# EAGLE design POE (EAGLE 6.2)
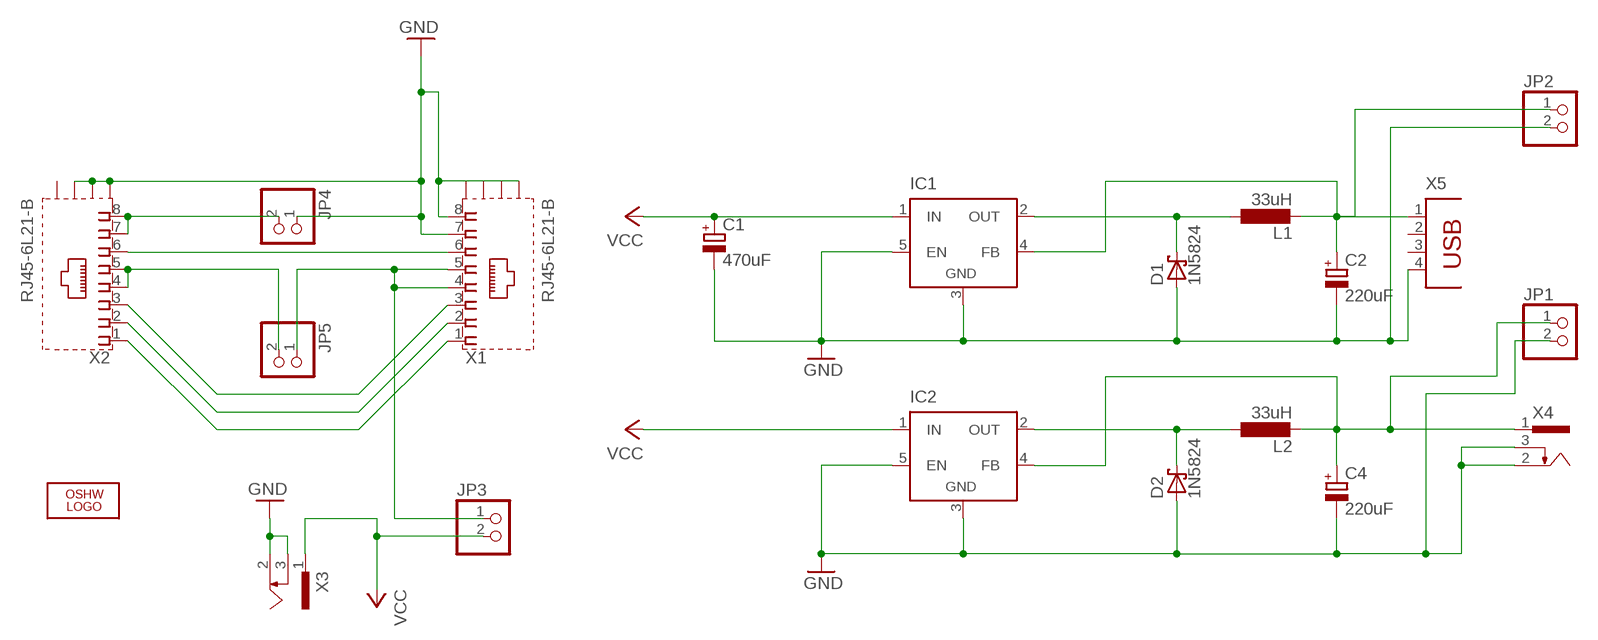
[diagram p0: schematic, sheet 1]

## Parts
C1  470uF  CPOL-EUE3.5-8  [E3,5-8]
C2  220uF  CPOL-EUE2.5-7  [E2,5-7]
C4  220uF  CPOL-EUE2.5-7  [E2,5-7]
D1  1N5824  BAT19  [DO35-10]
D2  1N5824  BAT19  [DO35-10]
IC1  LM2596TV  [TO220-51]
IC2  LM2596TV  [TO220-51]
JP1  PINHD-1X2  [1X02]
JP2  PINHD-1X2  [1X02]
JP3  PINHD-1X2  [1X02]
JP4  PINHD-1X2  [1X02]
JP5  PINHD-1X2  [1X02]
L1  33uH  L-EU6000-XXX-RC  [6000-XXXX-RC]
L2  33uH  L-EU6000-XXX-RC  [6000-XXXX-RC]
LOGO1  OSHW_LOGO_6MILX0200-NT  [OSHW_6X200_NOTEXT]
X1  RJ45-6L21-B  [RJ45-SHIELD1]
X2  RJ45-6L21-B  [RJ45-SHIELD1]
X3  733980-62  [733980-62]
X4  733980-62  [733980-62]
X5  PN87520  [PN87520]

## Nets
GND: C1.- C2.- C4.- D1.A D2.A IC1.3(GND) IC1.5(EN) IC2.3(GND) IC2.5(EN) JP1.2 JP2.2 JP4.1 X1.7 X1.8 X1.S1(S) X1.S2(S) X1.S4(S) X2.S1(S) X2.S2(S) X2.S3(S) X3.2 X3.3 X4.2 X4.3 X5.4
N$1: D1.C IC1.2(OUT) L1.1
N$2: C2.+ IC1.4(FB) JP2.1 L1.2 X5.1
N$3: X1.6 X2.6
N$4: D2.C IC2.2(OUT) L2.1
N$5: C4.+ IC2.4(FB) JP1.1 L2.2 X4.1
N$6: X1.3 X2.3
N$7: X1.2 X2.2
N$8: X1.1 X2.1
N$9: JP3.1 JP5.1 X1.4 X1.5
N$10: JP4.2 X2.7 X2.8
N$11: JP5.2 X2.4 X2.5
VCC: C1.+ IC1.1(IN) IC2.1(IN) JP3.2 X3.1
Unconnected: X1.S3(S) X2.S4(S) X5.2 X5.3

## Library data of the parts
C1 C2 C4 = rcl:CPOL-EU: POLARIZED CAPACITOR, European symbol
D1 D2 = diode:BAT19: DIODE barrier diode
IC1 IC2 = linear:LM2596T: STEP-DOWN VOLTAGE REGULATOR
JP1-JP5 = pinhead:PINHD-1X2: PIN HEADER
L1 L2 = rcl:L-EU: INDUCTOR, European symbol
LOGO1 = ohw-logo:OSHW_LOGO_6MIL
X1 X2 = con-tycoelectronics:RJ45*2: RJ45 Low Profile Shield Type 2 For all RJ45 L, LC, LCT and X Series Models Source: www.tycoelectronics.com .. ENG_DS_1654001_1099_RJ_L_0507.pdf; OC_FARNELL: unknown; OC_NEWARK: unknown
X3 X4 = con-conrad:73398?: FEMALE PRINT CONNECTOR Niedervolt-Steckverbinder Distributor Conrad
X5 = con-berg:PN87520: BERG USB connector; OC_FARNELL: unknown; OC_NEWARK: unknown

## Board
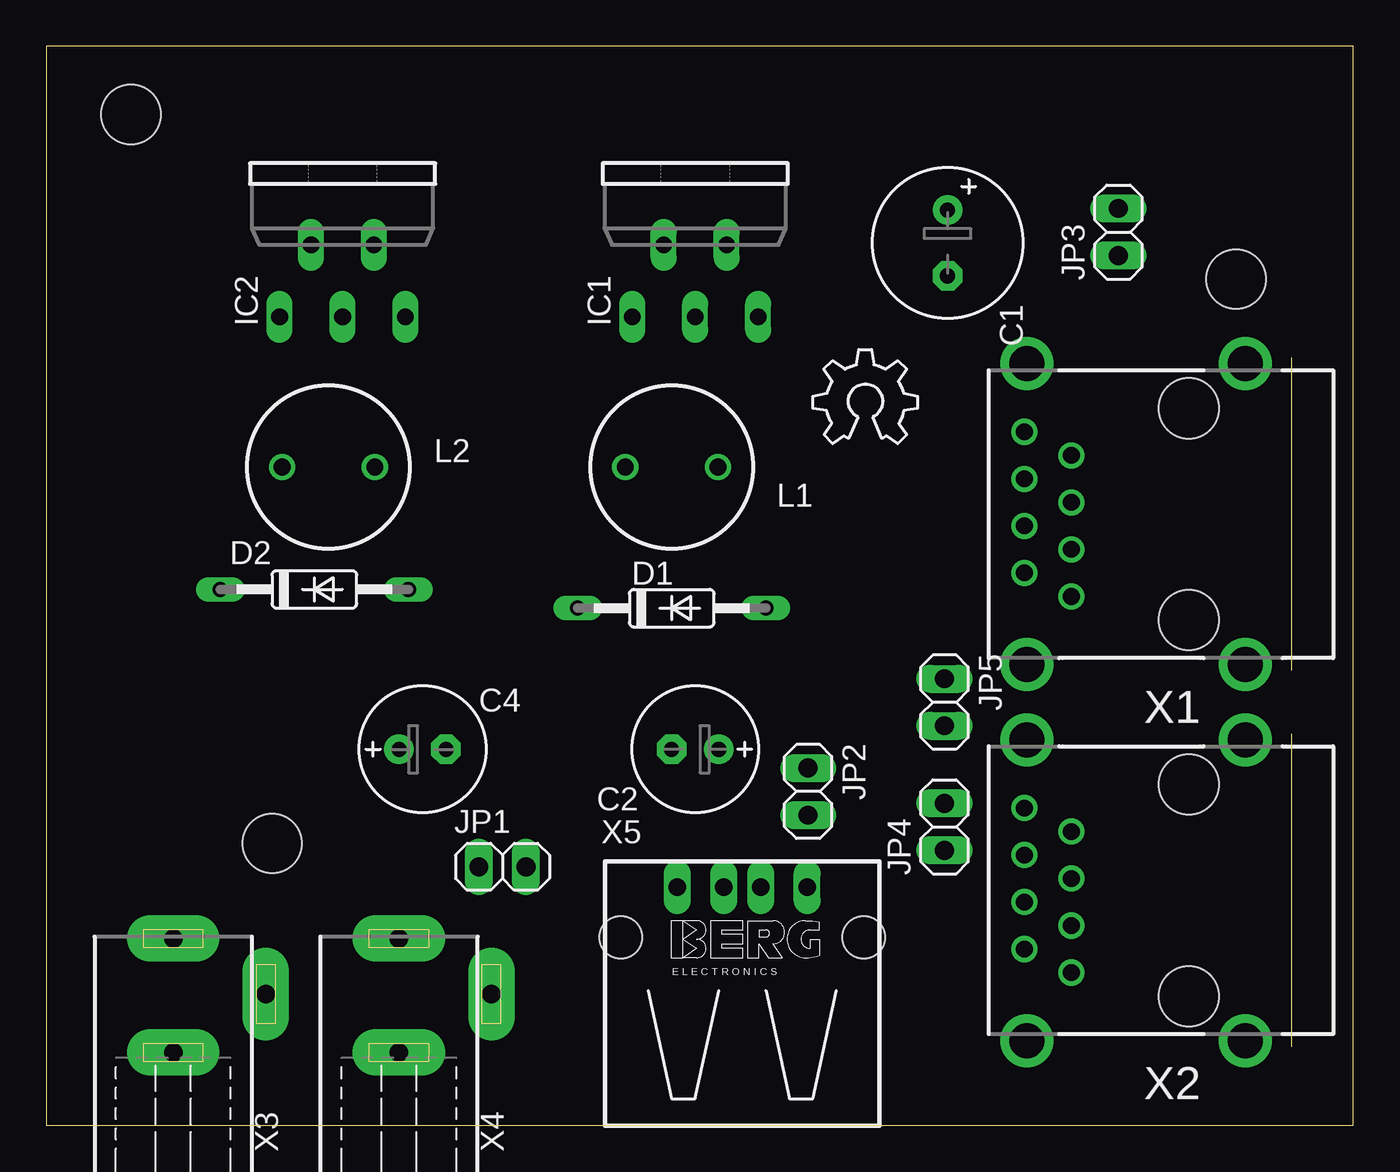
[diagram p1: board, top side]
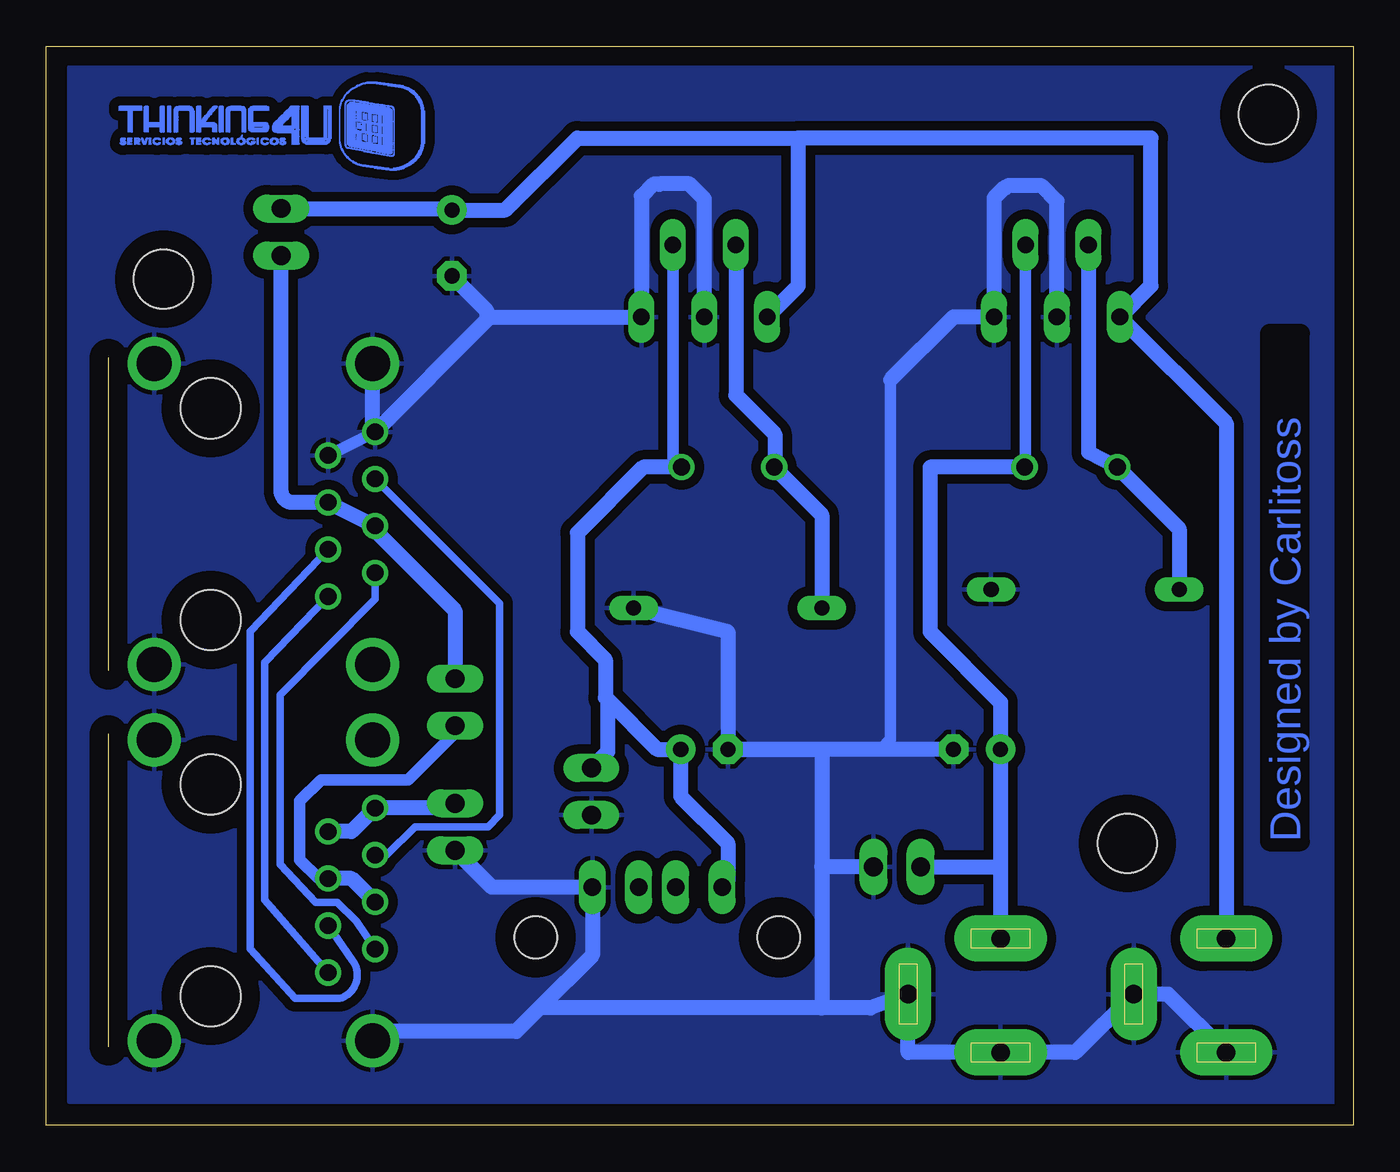
[diagram p2: board, bottom side, seen from below]

Size 70.59 x 58.29 mm. Coordinates in mm from the lower left corner, seen from the top.
Outline: 0,0 70.59,0 70.59,58.29 0,58.29 0,0
Copper layers (1*16): Top 0.035mm / dielectric 1.5mm / Bottom 0.035mm
Design rules: minimum track width 10mil, minimum drill 24mil, track to track 20mil, track to pad 20mil, pad to pad 15mil, via to via 8mil, smd to smd 8mil, copper to edge 40mil, drill to drill 8mil, minimum pad ring 10mil, minimum via ring 8mil, stop-mask expansion 4mil, vias tented up to drill 0mil, thermal gap 10mil
Holes 3.2 mm at 64.26,45.72 12.19,15.24 4.57,54.61

### Footprints (pad centres in the part's own frame; a part is rotated, then mirrored left to right if it is on the bottom)
E3,5-8 = drill 0.813 pad 1.6: + -1.778,0 | drill 0.813 pad 1.6 octagon: - 1.778,0
E2,5-7 = drill 0.813 pad 1.6: + -1.27,0 | drill 0.813 pad 1.6 octagon: - 1.27,0
DO35-10 = drill 0.813 long: A 5.08,0; C -5.08,0
TO220-51 = drill 0.9 long: 1 -3.4,-8.4; 2 -1.7,-4.5; 3 0,-8.4; 4 1.7,-4.5; 5 3.4,-8.4
1X02 = drill 1.016 long: 1 -1.27,0; 2 1.27,0
6000-XXXX-RC = drill 0.9 pad 1.422: 1 -2.5,0; 2 2.5,0
RJ45-SHIELD1 = drill 0.9 pad 1.4: 1 -4.445,6.35; 2 -3.175,8.89; 3 -1.905,6.35; 4 -0.635,8.89; 5 0.635,6.35; 6 1.905,8.89; 7 3.175,6.35; 8 4.445,8.89 | drill 1.9 pad 2.5: S1 -8.128,-3.048; S2 8.128,-3.048; S3 -8.128,8.76; S4 8.128,8.76 | hole 3.251: -5.715,0; 5.715,0
733980-62 = drill 1 pad 2.5 long: 1 0,8.57; 2 0,2.42; 3 5,5.57
PN87520 = drill 0.95 long: 1 -3.5,2.71; 2 -1,2.71; 3 1,2.71; 4 3.5,2.71 | hole 2.3: -6.57,0; 6.57,0

### Placement (x,y rotation side)
C1  48.68,47.67 270 top
C2  35.05,20.32 180 top
C4  20.32,20.32 0 top
D1  33.78,27.94 0 top
D2  14.48,28.96 0 top
IC1  35.05,52.07 0 top
IC2  16,52.07 0 top
JP1  24.64,13.97 0 top
JP2  41.15,18.03 270 top
JP3  57.91,48.26 90 top
JP4  48.51,16.13 90 top
JP5  48.51,22.86 270 top
L1  33.78,35.56 0 top
L2  15.24,35.56 0 top
LOGO1  41.4,36.83 0 top
X1  61.72,33.02 90 top
X2  61.72,12.7 90 top
X3  6.86,1.52 0 top
X4  19.05,1.52 0 top
X5  37.59,10.16 0 top

### Tracks (layer width: path | path; a pad name or v marks a point on that pad's centre or on a via)
GND
  Bottom 0.406: X1.8 52.69,37.32
  Bottom 0.61: 24.99,40.28 24.99,20.84 25.51,20.32 | X1.7 X1.8
  Bottom 0.813: 46.8,43.5 X1.8 52.96,37.59 X1.S4 | 46.8,43.5 46.63,43.67 IC1.5 | C4.- 25.51,20.32 C2.- | D1.A 33.78,26.67 C2.- | 38.4,43.72 IC1.5 | IC2.3 16,49.93 16.83,50.75 18.68,50.75 18.78,50.65 18.85,50.65 19.4,50.1 IC2.5 21.59,43.67 24.99,40.28 | IC1.5 38.45,50.2 37.81,50.84 37.48,50.84 37.46,50.86 35.87,50.86 35.05,50.05 IC1.3 | 43.94,6.35 41.09,9.2 X5.4 46.53,12.87 JP4.1 | 43.94,6.35 45.21,5.08 52.45,5.08 | C2.- 28.7,20.32 28.7,13.97 | 28.7,13.97 28.7,6.35 | 28.7,6.35 43.94,6.35 | C1.- 46.8,44.01 46.8,43.5 | 28.7,6.35 26.06,6.35 X4.3 24.05,3.94 X4.2 15.01,3.94 X3.3 10.01,7.09 X3.2 | JP1.2 28.7,13.97
  pour Bottom: 0.76,57.15 69.34,57.15 69.34,1.27 0.76,1.27
N$1
  Bottom 0.813: IC1.2 33.35,39.45 31.24,37.34 31.24,35.6 L1.1 28.7,32.98 D1.C
N$2
  Bottom 0.61: IC1.4 36.75,35.56 L1.2
  Bottom 0.813: X5.1 33.78,13.18 33.78,15.24 36.32,17.78 C2.+ 37.59,20.32 40.26,22.99 | L1.2 38.35,35.56 41.91,32 41.91,26.67 40.39,25.15 40.39,23.11 40.26,22.99 | JP2.1 40.26,20.19 40.26,22.99
N$3
  Bottom 0.406: X1.6 46.1,28.19 46.1,16.76 46.74,16.13 50.67,16.13 52.2,14.6 X2.6
N$4
  Bottom 0.813: IC2.2 14.3,36.36 L2.1 9.4,32.22 D2.C
N$5
  Bottom 0.61: IC2.4 17.7,36.36 L2.2
  Bottom 0.813: L2.2 22.86,35.56 22.86,26.67 19.05,22.86 C4.+ 19.05,13.97 | X4.1 19.05,13.72 19.05,13.97 | JP1.1 19.05,13.97
N$6
  Bottom 0.406: X1.3 59.57,26.69 59.57,9.54 57.15,6.86 54.74,6.86 arc-108 54.03,8.9 X2.3
N$7
  Bottom 0.406: X1.2 52.83,28.45 57.95,23.24 57.95,14.1 56.04,12.05 54.9,12.05 53.85,11.05 X2.2
N$8
  Bottom 0.406: X2.1 58.79,12.18 58.79,25.01 X1.1
N$9
  Bottom 0.813: JP3.1 57.91,34.29 arc-90 57.28,33.66 X1.5 X1.4 52.83,32.13 48.51,27.81 JP5.1
N$10
  Bottom 0.813: JP4.2 48.77,17.14 X2.8 54.1,15.88 X2.7
N$11
  Bottom 0.61: JP5.2 48.51,21.21 51.05,18.67 55.75,18.67 56.9,17.53 56.9,14.35 55.88,13.33 X2.5
  Bottom 0.813: X2.4 54.1,13.33 X2.5
VCC
  Bottom 0.813: IC1.1 29.97,45.35 29.97,53.34 | 29.97,53.34 10.92,53.34 10.92,45.35 IC2.1 6.86,37.93 X3.1 | JP3.2 48.77,49.53 arc90 C1.+ 45.8,49.45 41.91,53.34 29.97,53.34
(copper drawn outside any net)
  shapes: Bottom area x2245

### Text on the board
Bottom: Designed by Carlitoss